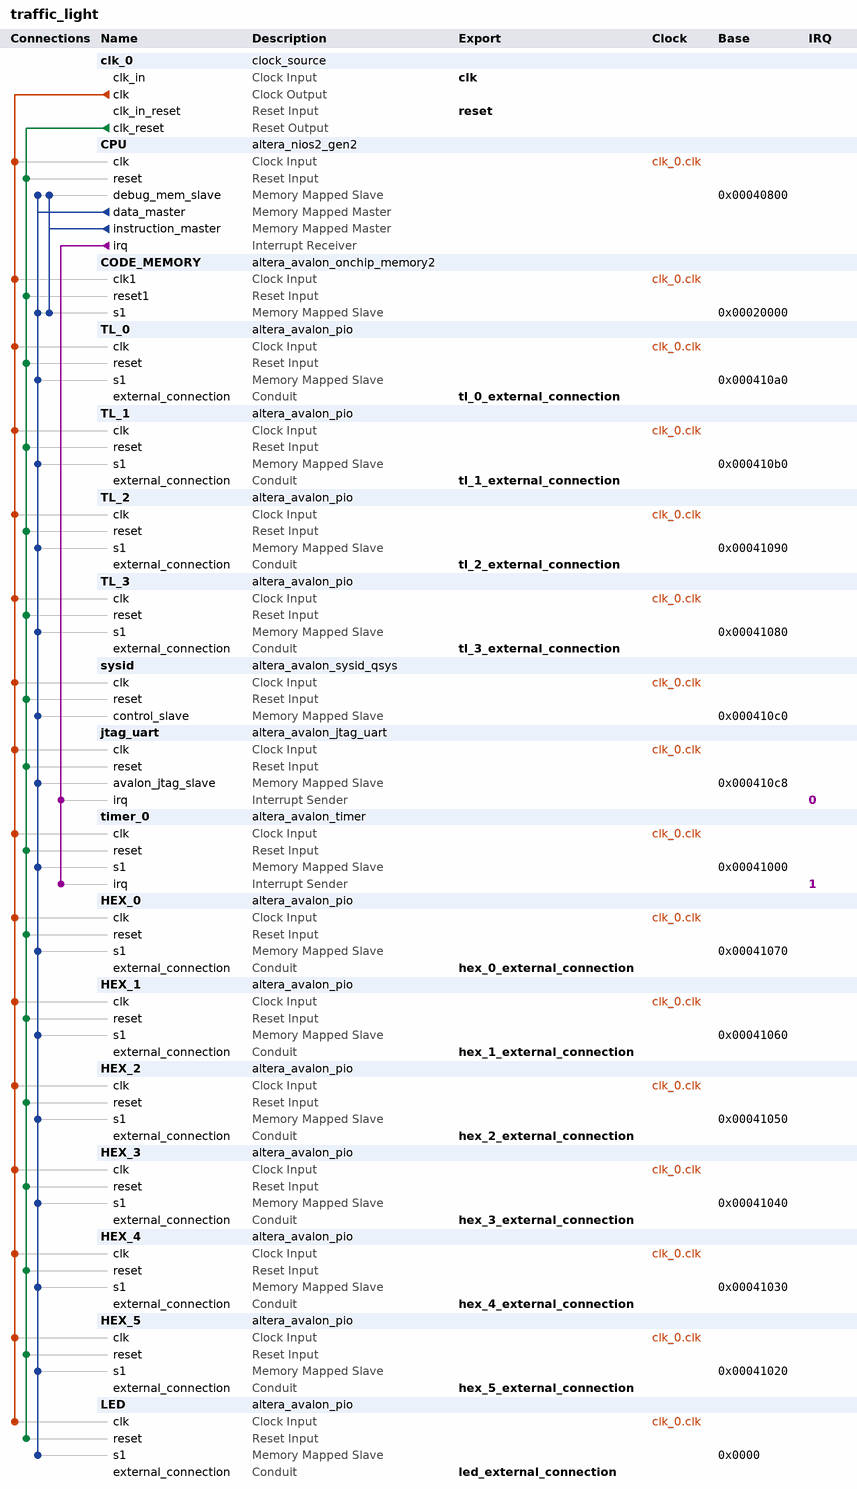
[diagram p0: system contents]
# Platform Designer (Qsys) system traffic_light, Cyclone IV E EP4CE22F17C6
# Parameters at their usual value, and those the tool derives, are not listed.
package require -exact qsys 18.1
create_system traffic_light
set_project_property DEVICE_FAMILY {Cyclone IV E}
set_project_property DEVICE EP4CE22F17C6

add_instance clk_0 clock_source 18.1
set_instance_parameter_value clk_0 clockFrequency 50000000

add_instance CPU altera_nios2_gen2 18.1
set_instance_parameter_value CPU dcache_size 2048
set_instance_parameter_value CPU exceptionSlave CODE_MEMORY.s1
set_instance_parameter_value CPU icache_size 4096
set_instance_parameter_value CPU impl Tiny
set_instance_parameter_value CPU resetSlave CODE_MEMORY.s1

add_instance CODE_MEMORY altera_avalon_onchip_memory2 18.1
set_instance_parameter_value CODE_MEMORY dataWidth 32
set_instance_parameter_value CODE_MEMORY dualPort false
set_instance_parameter_value CODE_MEMORY initMemContent true
set_instance_parameter_value CODE_MEMORY initializationFileName onchip_mem.hex
set_instance_parameter_value CODE_MEMORY memorySize 49152

add_instance TL_0 altera_avalon_pio 18.1
set_instance_parameter_value TL_0 direction Output
set_instance_parameter_value TL_0 width 3

add_instance TL_1 altera_avalon_pio 18.1
set_instance_parameter_value TL_1 direction Output
set_instance_parameter_value TL_1 width 3

add_instance TL_2 altera_avalon_pio 18.1
set_instance_parameter_value TL_2 direction Output
set_instance_parameter_value TL_2 width 3

add_instance TL_3 altera_avalon_pio 18.1
set_instance_parameter_value TL_3 direction Output
set_instance_parameter_value TL_3 width 3

add_instance sysid altera_avalon_sysid_qsys 18.1
set_instance_parameter_value sysid id 0

add_instance jtag_uart altera_avalon_jtag_uart 18.1
set_instance_parameter_value jtag_uart simInteractiveOptions NO_INTERACTIVE_WINDOWS

add_instance timer_0 altera_avalon_timer 18.1
set_instance_parameter_value timer_0 period 1
set_instance_parameter_value timer_0 periodUnits MSEC

add_instance HEX_0 altera_avalon_pio 18.1
set_instance_parameter_value HEX_0 direction Output
set_instance_parameter_value HEX_0 width 4

add_instance HEX_1 altera_avalon_pio 18.1
set_instance_parameter_value HEX_1 direction Output
set_instance_parameter_value HEX_1 width 4

add_instance HEX_2 altera_avalon_pio 18.1
set_instance_parameter_value HEX_2 direction Output
set_instance_parameter_value HEX_2 width 8

add_instance HEX_3 altera_avalon_pio 18.1
set_instance_parameter_value HEX_3 direction Output
set_instance_parameter_value HEX_3 width 8

add_instance HEX_4 altera_avalon_pio 18.1
set_instance_parameter_value HEX_4 direction Output
set_instance_parameter_value HEX_4 width 8

add_instance HEX_5 altera_avalon_pio 18.1
set_instance_parameter_value HEX_5 direction Output
set_instance_parameter_value HEX_5 width 8

add_instance LED altera_avalon_pio 18.1
set_instance_parameter_value LED direction Output
set_instance_parameter_value LED width 1

# connections
add_connection clk_0.clk CODE_MEMORY.clk1 clock
add_connection clk_0.clk CPU.clk clock
add_connection clk_0.clk HEX_0.clk clock
add_connection clk_0.clk HEX_1.clk clock
add_connection clk_0.clk HEX_2.clk clock
add_connection clk_0.clk HEX_3.clk clock
add_connection clk_0.clk HEX_4.clk clock
add_connection clk_0.clk HEX_5.clk clock
add_connection clk_0.clk jtag_uart.clk clock
add_connection clk_0.clk LED.clk clock
add_connection clk_0.clk sysid.clk clock
add_connection clk_0.clk timer_0.clk clock
add_connection clk_0.clk TL_0.clk clock
add_connection clk_0.clk TL_1.clk clock
add_connection clk_0.clk TL_2.clk clock
add_connection clk_0.clk TL_3.clk clock
add_connection clk_0.clk_reset CODE_MEMORY.reset1 reset
add_connection clk_0.clk_reset CPU.reset reset
add_connection clk_0.clk_reset HEX_0.reset reset
add_connection clk_0.clk_reset HEX_1.reset reset
add_connection clk_0.clk_reset HEX_2.reset reset
add_connection clk_0.clk_reset HEX_3.reset reset
add_connection clk_0.clk_reset HEX_4.reset reset
add_connection clk_0.clk_reset HEX_5.reset reset
add_connection clk_0.clk_reset jtag_uart.reset reset
add_connection clk_0.clk_reset LED.reset reset
add_connection clk_0.clk_reset sysid.reset reset
add_connection clk_0.clk_reset timer_0.reset reset
add_connection clk_0.clk_reset TL_0.reset reset
add_connection clk_0.clk_reset TL_1.reset reset
add_connection clk_0.clk_reset TL_2.reset reset
add_connection clk_0.clk_reset TL_3.reset reset
add_connection CPU.data_master CODE_MEMORY.s1 avalon
set_connection_parameter_value CPU.data_master/CODE_MEMORY.s1 baseAddress 0x00020000
add_connection CPU.data_master CPU.debug_mem_slave avalon
set_connection_parameter_value CPU.data_master/CPU.debug_mem_slave baseAddress 0x00040800
add_connection CPU.data_master HEX_0.s1 avalon
set_connection_parameter_value CPU.data_master/HEX_0.s1 baseAddress 0x00041070
add_connection CPU.data_master HEX_1.s1 avalon
set_connection_parameter_value CPU.data_master/HEX_1.s1 baseAddress 0x00041060
add_connection CPU.data_master HEX_2.s1 avalon
set_connection_parameter_value CPU.data_master/HEX_2.s1 baseAddress 0x00041050
add_connection CPU.data_master HEX_3.s1 avalon
set_connection_parameter_value CPU.data_master/HEX_3.s1 baseAddress 0x00041040
add_connection CPU.data_master HEX_4.s1 avalon
set_connection_parameter_value CPU.data_master/HEX_4.s1 baseAddress 0x00041030
add_connection CPU.data_master HEX_5.s1 avalon
set_connection_parameter_value CPU.data_master/HEX_5.s1 baseAddress 0x00041020
add_connection CPU.data_master jtag_uart.avalon_jtag_slave avalon
set_connection_parameter_value CPU.data_master/jtag_uart.avalon_jtag_slave baseAddress 0x000410c8
add_connection CPU.data_master LED.s1 avalon
set_connection_parameter_value CPU.data_master/LED.s1 baseAddress 0x0000
add_connection CPU.data_master sysid.control_slave avalon
set_connection_parameter_value CPU.data_master/sysid.control_slave baseAddress 0x000410c0
add_connection CPU.data_master timer_0.s1 avalon
set_connection_parameter_value CPU.data_master/timer_0.s1 baseAddress 0x00041000
add_connection CPU.data_master TL_0.s1 avalon
set_connection_parameter_value CPU.data_master/TL_0.s1 baseAddress 0x000410a0
add_connection CPU.data_master TL_1.s1 avalon
set_connection_parameter_value CPU.data_master/TL_1.s1 baseAddress 0x000410b0
add_connection CPU.data_master TL_2.s1 avalon
set_connection_parameter_value CPU.data_master/TL_2.s1 baseAddress 0x00041090
add_connection CPU.data_master TL_3.s1 avalon
set_connection_parameter_value CPU.data_master/TL_3.s1 baseAddress 0x00041080
add_connection CPU.instruction_master CODE_MEMORY.s1 avalon
set_connection_parameter_value CPU.instruction_master/CODE_MEMORY.s1 baseAddress 0x00020000
add_connection CPU.instruction_master CPU.debug_mem_slave avalon
set_connection_parameter_value CPU.instruction_master/CPU.debug_mem_slave baseAddress 0x00040800
add_connection CPU.irq jtag_uart.irq interrupt
set_connection_parameter_value CPU.irq/jtag_uart.irq irqNumber 0
add_connection CPU.irq timer_0.irq interrupt
set_connection_parameter_value CPU.irq/timer_0.irq irqNumber 1

# exported interfaces
add_interface clk clock sink
set_interface_property clk EXPORT_OF clk_0.clk_in
add_interface hex_0_external_connection conduit end
set_interface_property hex_0_external_connection EXPORT_OF HEX_0.external_connection
add_interface hex_1_external_connection conduit end
set_interface_property hex_1_external_connection EXPORT_OF HEX_1.external_connection
add_interface hex_2_external_connection conduit end
set_interface_property hex_2_external_connection EXPORT_OF HEX_2.external_connection
add_interface hex_3_external_connection conduit end
set_interface_property hex_3_external_connection EXPORT_OF HEX_3.external_connection
add_interface hex_4_external_connection conduit end
set_interface_property hex_4_external_connection EXPORT_OF HEX_4.external_connection
add_interface hex_5_external_connection conduit end
set_interface_property hex_5_external_connection EXPORT_OF HEX_5.external_connection
add_interface led_external_connection conduit end
set_interface_property led_external_connection EXPORT_OF LED.external_connection
add_interface reset reset sink
set_interface_property reset EXPORT_OF clk_0.clk_in_reset
add_interface tl_0_external_connection conduit end
set_interface_property tl_0_external_connection EXPORT_OF TL_0.external_connection
add_interface tl_1_external_connection conduit end
set_interface_property tl_1_external_connection EXPORT_OF TL_1.external_connection
add_interface tl_2_external_connection conduit end
set_interface_property tl_2_external_connection EXPORT_OF TL_2.external_connection
add_interface tl_3_external_connection conduit end
set_interface_property tl_3_external_connection EXPORT_OF TL_3.external_connection

set_interconnect_requirement {$system} qsys_mm.clockCrossingAdapter HANDSHAKE
set_interconnect_requirement {$system} qsys_mm.enableEccProtection FALSE
set_interconnect_requirement {$system} qsys_mm.insertDefaultSlave FALSE
set_interconnect_requirement {$system} qsys_mm.maxAdditionalLatency 1

save_system traffic_light.qsys
